# EAGLE design Motor and Gas (EAGLE 9.0.1)
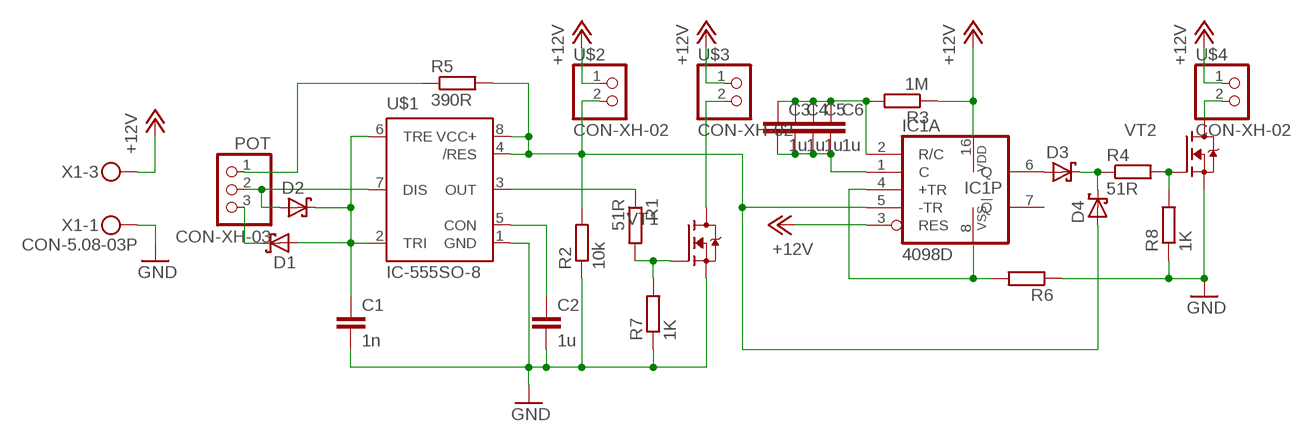
[diagram p0: schematic, sheet 1]

## Parts
C1  1n  CAP_1206  [C1206]
C2  1u  CAP_1206  [C1206]
C3  1u  CAP_1206  [C1206]
C4  1u  CAP_1206  [C1206]
C5  1u  CAP_1206  [C1206]
C6  1u  CAP_1206  [C1206]
D1  DIODE-SH_SOD523  [SOD523]
D2  DIODE-SH_SOD523  [SOD523]
D3  DIODE-SH_SOD523  [SOD523]
D4  DIODE-SH_SOD523  [SOD523]
IC1  4098D  [SO16]
POT  CON-XH-03  [XH-03]
R1  51R  R_1206  [R1206]
R2  10k  R_1206  [R1206]
R3  1M  R_1206  [R1206]
R4  51R  R_1206  [R1206]
R5  390R  R_1206  [R1206]
R6  R_0805  [R0805]
R7  1K  R_0805  [R0805]
R8  1K  R_0805  [R0805]
U$1  IC-555SO-8  [SOIC127P600X175-8]
U$2  CON-XH-02  [XH-02]
U$3  CON-XH-02  [XH-02]
U$4  CON-XH-02  [XH-02]
VT1  FET-NPF-6X5  [POWERFLAT-5X6]
VT2  FET-NPF-6X5  [POWERFLAT-5X6]
X1  CON-5.08-03P  [MKDSN1,5/3-5,08]

## Nets
+12V: IC1.3(A:RES) IC1.16(P:VDD) R3.1 U$2.1 U$3.1 U$4.1 X1.3
GND: C1.2 C2.2 R2.1 R6.1 R7.1 R8.1 U$1.1(GND) VT1.S1(S) VT1.S2(S) VT1.S3(S) VT2.S1(S) VT2.S2(S) VT2.S3(S) X1.1
N$1: U$3.2 VT1.D1(D)
N$2: C1.1 D1.A D2.C U$1.2(TRI) U$1.6(TRE)
N$3: C2.1 U$1.5(CON)
N$4: D2.A POT.2 U$1.7(DIS)
N$5: D1.C POT.3
N$6: POT.1 R5.1
N$7: R1.1 U$1.3(OUT)
N$8: R1.2 R7.2 VT1.G
N$9: D4.A IC1.5(A:-TR) R2.2 R5.2 U$1.4(/RES) U$1.8(VCC+) U$2.2
N$10: C3.2 C4.2 C5.2 C6.2 IC1.1(A:C)
N$11: C3.1 C4.1 C5.1 C6.1 IC1.2(A:R/C) R3.2
N$12: D3.A IC1.6(A:Q)
N$13: R4.2 R8.2 VT2.G
N$14: IC1.4(A:+TR) IC1.8(P:VSS) R6.2
N$15: U$4.2 VT2.D1(D)
N$16: D3.C D4.C R4.1
Unconnected: IC1.7(A:!Q) IC1.9(B:!Q) IC1.10(B:Q) IC1.11(B:-TR) IC1.12(B:+TR) IC1.13(B:RES) IC1.14(B:R/C) IC1.15(B:C) X1.2

## Library data of the parts
C1-C6 = Flamberm:CAP_
D1-D4 = Flamberm:DIODE-SH_
IC1 = 40xx:4098: Dual monostable MULTIVIBRATOR Source: Texas Instruments (Data sheet acquired frm Harris Semiconductor SCHS065) http://pdf1.alldatasheet.com/datasheet-pdf/view/26897/TI/CD4098.html
POT = Flamberm:CON-XH-03
R1-R8 = Flamberm:R_
U$1 = Flamberm:IC-555
U$2-U$4 = Flamberm:CON-XH-02
VT1 VT2 = Flamberm:FET-N
X1 = Flamberm:CON-5.08-03P: MKDSN 1,5/ 3-5,08 Printklemme Nennstrom: 13,5 A Nennspannung: 250 V Rastermaß: 5,08 mm Polzahl: 3 Anschlussart: Schraubanschluss Montage: Löten Anschlussrichtung Leiter/Platine: 0 ° Artikelnummer: 1729131 Source: http://eshop.phoenixcontact.com .. 1729131.pdf

## Board
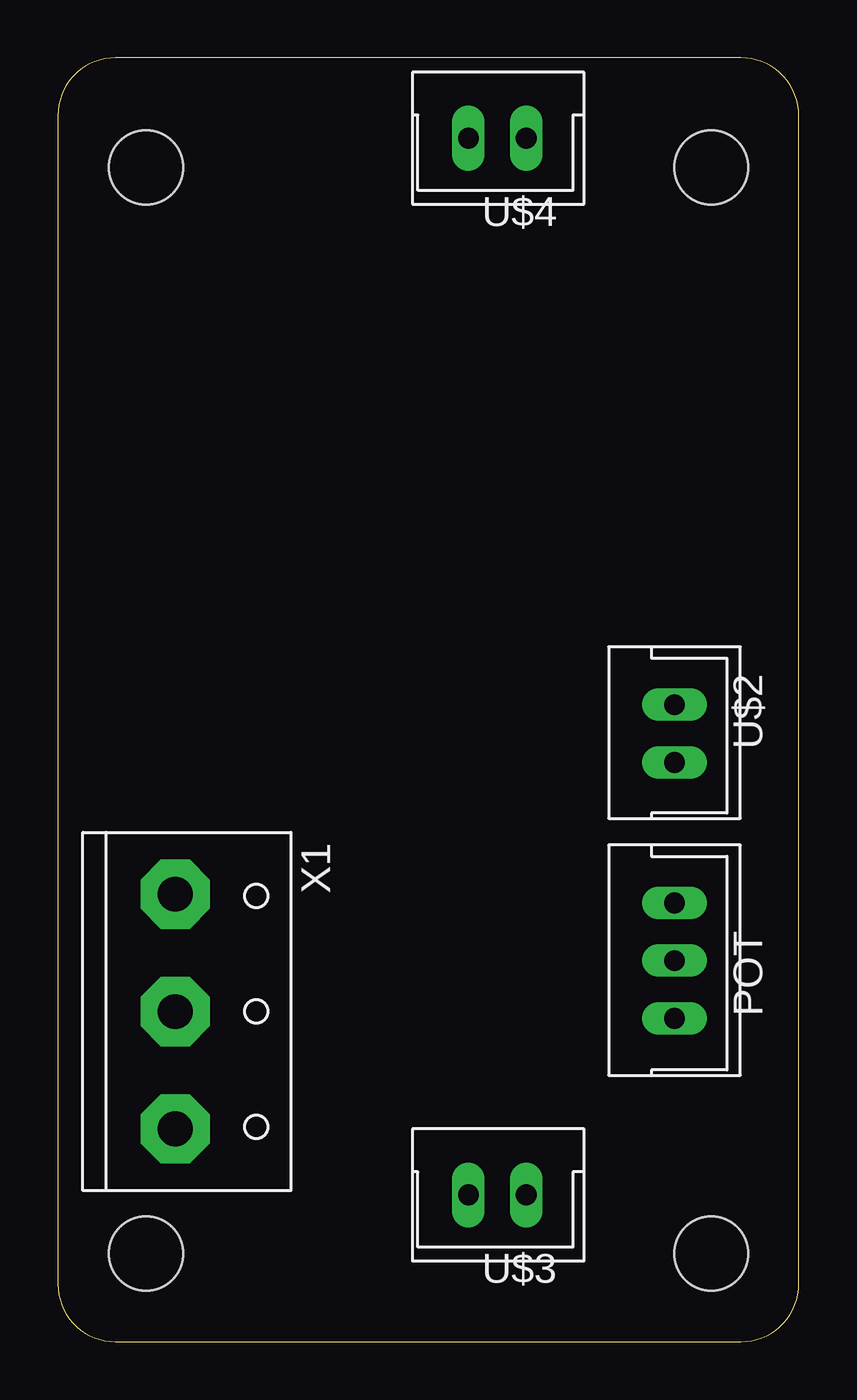
[diagram p1: board, top side]
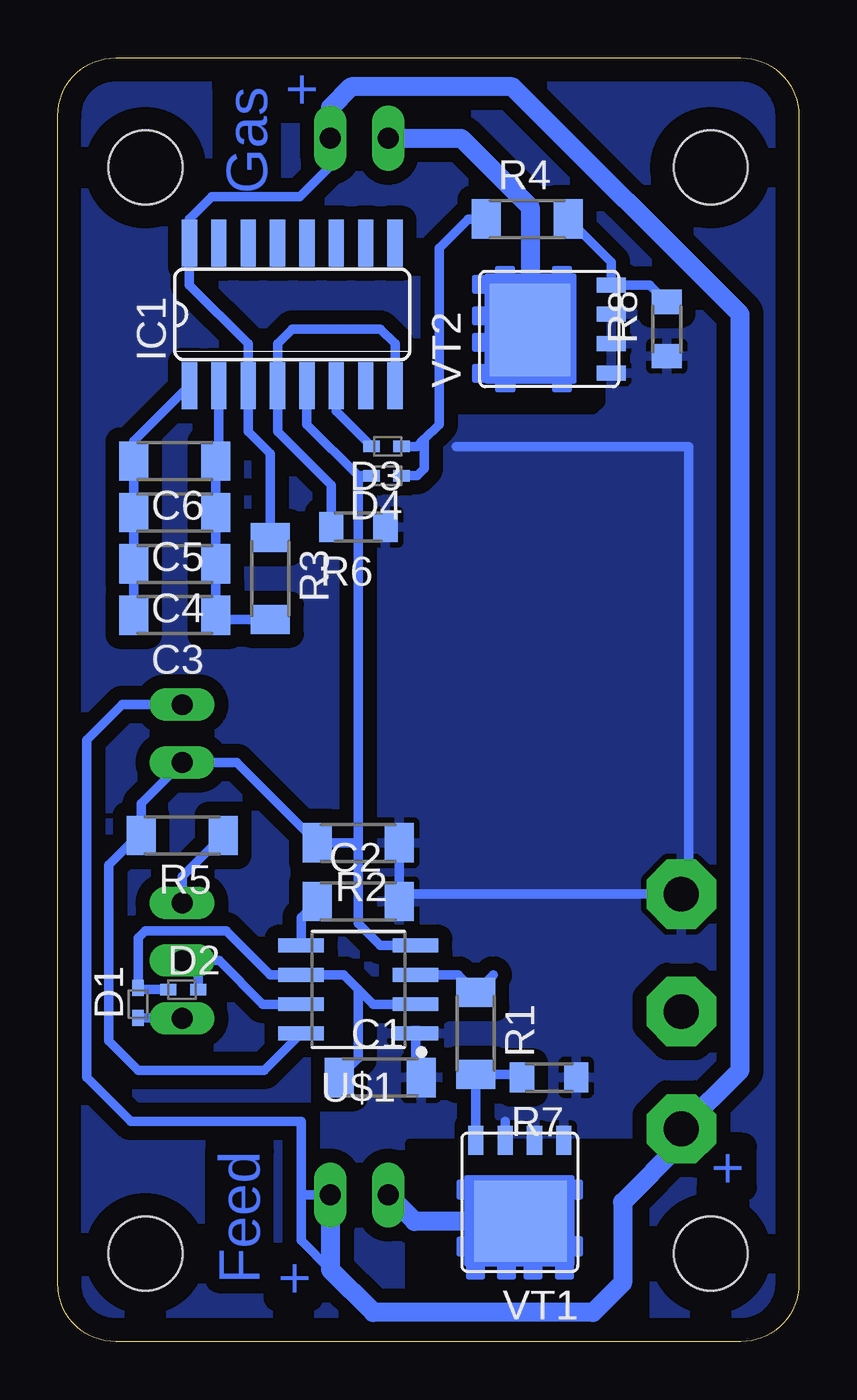
[diagram p2: board, bottom side, seen from below]

Size 32.05 x 55.55 mm. Coordinates in mm from the lower left corner, seen from the top.
Outline: 0,53.05 0,2.5 arc90 2.5,0 29.55,0 arc90 32.05,2.5 32.05,53.05 arc90 29.55,55.55 2.5,55.55 arc90 0,53.05
Copper layers (1*16): Top 0.035mm / dielectric 1.5mm / Bottom 0.035mm
Design rules "default": minimum track width 6mil, minimum drill 0.35mm, track to track 6mil, track to pad 6mil, pad to pad 6mil, via to via 6mil, smd to smd 6mil, copper to edge 40mil, drill to drill 6mil, minimum pad ring 10mil, minimum via ring 8mil, stop-mask expansion 4mil, vias tented up to drill 0mil, thermal gap 10mil
Holes 3.2 mm at 3.81,3.81 3.81,50.8 28.26,50.8 28.26,3.81

### Footprints (pad centres in the part's own frame; a part is rotated, then mirrored left to right if it is on the bottom)
C1206 = smd 1.25 x 1.7: 1 -1.775,0; 2 1.775,0
SOD523 = smd 0.7 x 0.5: A 0.7,0; C -0.6,0
SO16 = smd 0.66 x 2.032: 1 -4.445,-3.073; 2 -3.175,-3.073; 3 -1.905,-3.073; 4 -0.635,-3.073; 5 0.635,-3.073; 6 1.905,-3.073; 7 3.175,-3.073; 8 4.445,-3.073; 9 4.445,3.073; 10 3.175,3.073; 11 1.905,3.073; 12 0.635,3.073; 13 -0.635,3.073; 14 -1.905,3.073; 15 -3.175,3.073; 16 -4.445,3.073
XH-03 = drill 0.9 long: 1 -2.48,0; 2 0.02,0; 3 2.52,0
R1206 = smd 1.25 x 1.7: 1 -1.775,0; 2 1.775,0
R0805 = smd 1.05 x 1.3: 1 -1.175,0; 2 1.175,0
SOIC127P600X175-8 = smd 1.968 x 0.602: 1 -2.473,1.905; 2 -2.473,0.635; 3 -2.473,-0.635; 4 -2.473,-1.905; 5 2.473,-1.905; 6 2.473,-0.635; 7 2.473,0.635; 8 2.473,1.905
XH-02 = drill 0.9 long: 1 -1.21,0; 2 1.29,0
POWERFLAT-5X6 = smd 4 x 3.5: D1 -0.03,0.83 | smd 0.65 x 1.25: G 1.905,-2.685; S1 -1.905,-2.685; S2 -0.635,-2.685; S3 0.635,-2.685
MKDSN1,5/3-5,08 = drill 1.5 pad 3 octagon: 1 -5.08,0; 2 0,0; 3 5.08,0

### Placement (x,y rotation side)
C1  18.1,11.43 0 bottom
C2  19.05,19.05 0 bottom
C3  26.99,31.43 180 bottom
C4  26.99,33.66 180 bottom
C5  26.99,35.88 180 bottom
C6  26.99,38.1 180 bottom
D1  28.57,14.61 90 bottom
D2  26.67,15.24 0 bottom
D3  17.78,38.73 180 bottom
D4  17.78,37.47 180 bottom
IC1  21.91,44.45 0 bottom
POT  26.67,16.51 270 top
R1  13.97,13.34 270 bottom
R2  19.05,21.59 180 bottom
R3  22.86,33.02 270 bottom
R4  11.75,48.58 0 bottom
R5  26.67,21.91 180 bottom
R6  19.05,35.24 180 bottom
R7  10.79,11.43 180 bottom
R8  5.71,43.81 90 bottom
U$1  19.05,15.24 180 bottom
U$2  26.67,26.35 270 top
U$3  19.05,6.35 180 top
U$4  19.05,52.07 180 top
VT1  12.06,6.03 180 bottom
VT2  10.79,43.81 90 bottom
X1  5.08,14.29 270 top

### Tracks (layer width: path | path; a pad name or v marks a point on that pad's centre or on a via)
+12V
  Bottom 0.406: 21.52,6.35 21.52,9.53 28.89,9.53 30.8,11.43 30.8,26.04 29.27,27.56 U$2.1 | 21.52,6.35 21.52,4.38 20.26,3.12 | X1.3 5.08,8.57 | U$3.1 21.52,6.35 | 20.26,53.4 U$4.1 20.26,50.86 21.59,49.53 25.4,49.53 26.35,48.58 IC1.16 26.35,45.72 23.81,43.18 IC1.3 23.81,39.37 22.86,38.42 R3.1
  Bottom 0.813: 5.08,8.57 7.62,6.03 7.62,2.54 8.89,1.27 18.41,1.27 20.26,3.12 U$3.1 | X1.3 2.54,11.75 2.54,44.45 12.38,54.29 19.37,54.29 20.26,53.4
GND
  Bottom 0.406: U$1.1 16.58,12.13 16.32,11.87 C1.2 | VT1.S3 12.7,9.53 | R2.1 C2.2 16.96,19.37 X1.1 4.76,19.68 4.76,38.73 14.82,38.73
  pour Bottom (isolate 0.61, rank 6): 0,4.45 0,53.06 arc-90 2.5,55.56 17.14,55.56 29.57,55.56 arc-90 32.07,53.06 32.07,11.43 32.07,2.5 arc-90 29.57,0 8.26,0 2.5,0 arc-90 0,2.5
N$1
  Bottom 0.813: VT1.D1 16.61,5.2 U$3.2
N$2
  Bottom 0.406: U$1.2 18.41,14.61 19.05,15.24 | 19.05,15.24 19.68,15.88 U$1.6 22.86,15.88 24.77,17.78 27.3,17.78 28.26,17.78 28.57,17.46 D1.A 28.51,15.24 D2.C | C1.1 19.05,12.25 19.05,15.24
N$3
  Bottom 0.406: C2.1 21.52,18.35 U$1.5
N$4
  Bottom 0.406: POT.2 25.72,16.49 | 25.72,16.49 25.06,16.49 23.18,14.61 U$1.7 | D2.A 25.97,16.24 25.72,16.49
N$5
  Bottom 0.406: D1.C 26.68,14.01 POT.3
N$6
  Bottom 0.406: R5.1 26.67,20.13 POT.1
N$7
  Bottom 0.406: U$1.3 14.73,15.88 R1.1 13.21,15.88
N$8
  Bottom 0.406: VT1.G R1.2 12.1,11.56 R7.2
N$9
  Bottom 0.406: 19.05,21.59 19.05,18.1 18.1,17.14 U$1.4 | 19.05,21.59 R2.2 24.3,25.06 U$2.2 28.45,23.29 R5.2 28.57,21.91 29.84,20.64 29.84,13.02 28.57,11.75 23.11,11.75 U$1.8 | 19.05,37.47 19.05,21.59 | IC1.5 21.27,39.69 19.05,37.47 | D4.A 19.05,37.47
N$10
  Bottom 0.406: C3.2 C4.2 C5.2 C6.2 28.76,38.97 IC1.1
N$11
  Bottom 0.406: IC1.2 25.08,38.23 C6.1 C5.1 C4.1 C3.1 25.02,31.25 R3.2
N$12
  Bottom 0.406: D3.A 20,40.26 IC1.6
N$13
  Bottom 0.406: R4.2 8.11,46.72 VT2.G 6.45,45.72 R8.2
N$14
  Bottom 0.406: R6.2 20.23,37.05 22.54,39.37 IC1.4 22.54,43.18 21.91,43.81 18.1,43.81 17.46,43.18 IC1.8
N$15
  Bottom 0.813: U$4.2 14.61,52.07 11.62,49.09 VT2.D1
N$16
  Bottom 0.406: D4.C 16.51,37.47 16.19,37.78 16.19,39.05 | D3.C 16.51,38.73 16.19,39.05 | R4.1 14.29,48.58 15.56,47.31 15.56,39.69 16.19,39.05
N$17
  cutout Bottom (isolate 0.406, rank 5): 14.92,46.99 14.92,40.32 8.89,40.32 8.57,40.64 8.57,46.35 9.53,47.31 14.61,47.31
N$18
  cutout Bottom (isolate 0.406, rank 5): 16.83,8.57 6.67,8.57 6.67,1.27 16.83,1.27

### Text on the board
Bottom: Gas | + | Feed | + | +